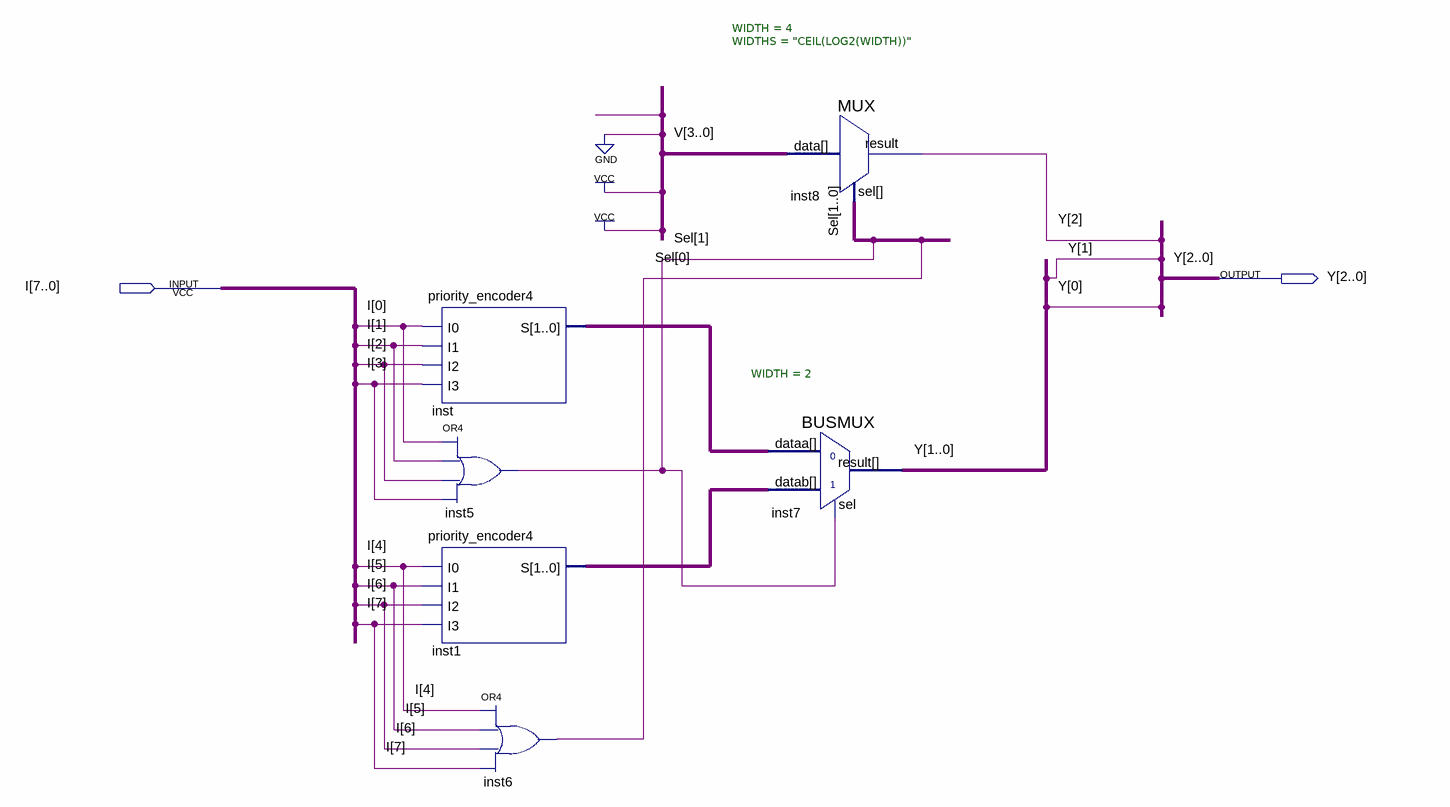
[diagram p0: schematic sheet]
// Quartus schematic priority_encoder8.bdf as structural Verilog: 6 symbols, 2 pins
module priority_encoder8 (
  input  [7:0] I,
  output [2:0] Y
);

  wire [1:0] inst1_s, inst_s, Sel;
  wire [3:0] V;

  priority_encoder4 inst (.I0(I[0]), .I1(I[1]), .I2(I[2]), .I3(I[3]), .S(inst_s));
  or inst5 (Sel[1], I[0], I[1], I[2], I[3]);
  priority_encoder4 inst1 (.I0(I[4]), .I1(I[5]), .I2(I[6]), .I3(I[7]), .S(inst1_s));
  or inst6 (Sel[0], I[4], I[5], I[6], I[7]);
  MUX #(.WIDTH(4), .WIDTHS("CEIL(LOG2(WIDTH))")) inst8 (.data(V), .sel(Sel), .result(Y[2]));
  BUSMUX #(.WIDTH(2)) inst7 (.datab(inst1_s), .sel(Sel[1]), .dataa(inst_s), .result(Y[1:0]));
endmodule
